# EAGLE design FCC3_Micro (EAGLE 7.2.0)
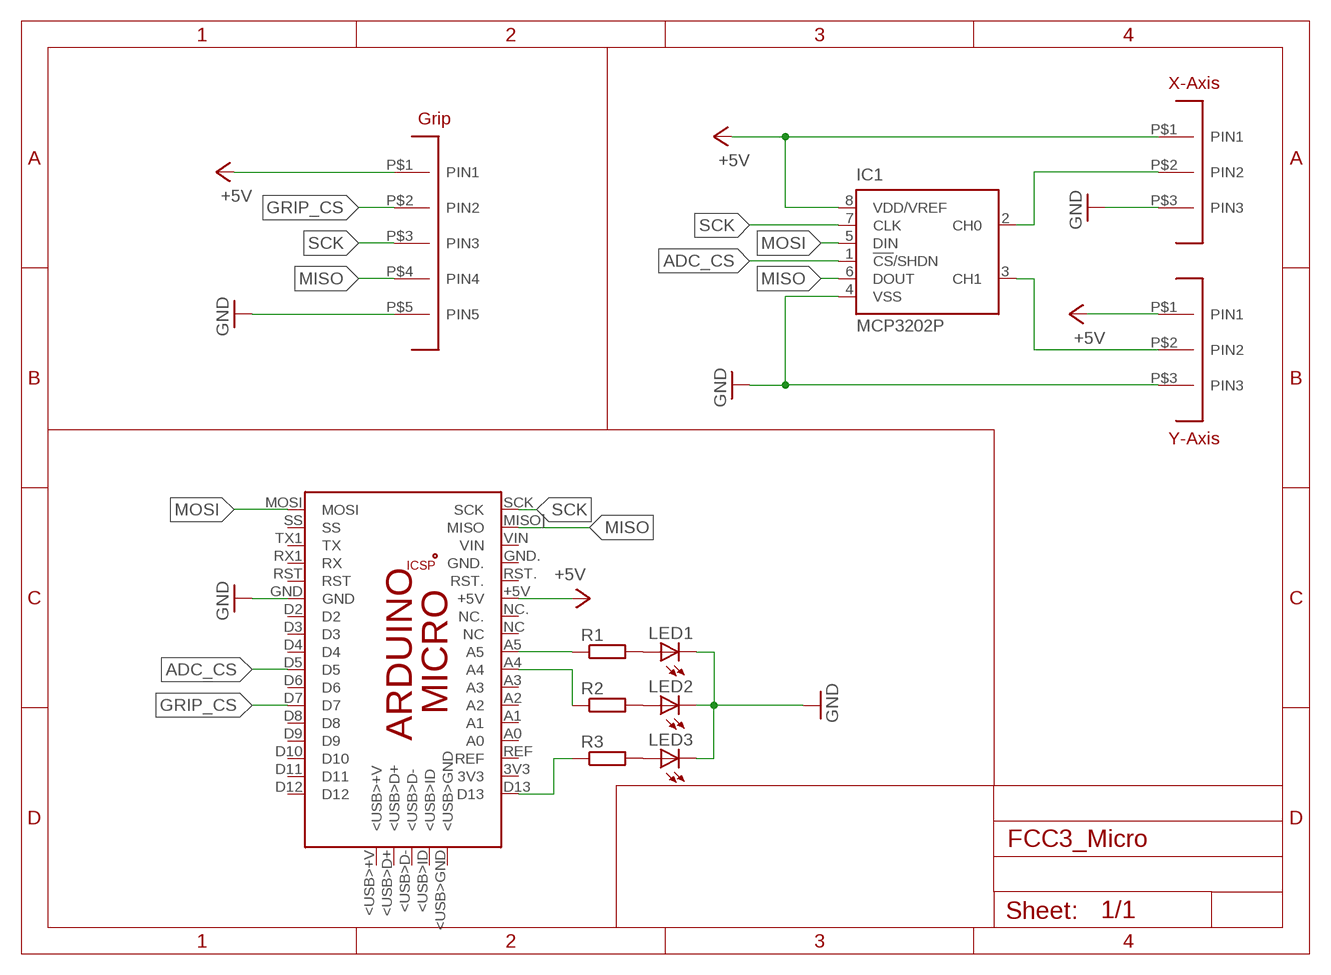
[diagram p0: schematic, sheet 1]

## Parts
IC1  MCP3202P  [DIL8]
LED1  LED5MM  [LED5MM]
LED2  LED5MM  [LED5MM]
LED3  LED5MM  [LED5MM]
PCB1  ARDUINO_MICRO  [ARDUINO_MICRO]
R1  R-EU_0204/5  [0204/5]
R2  R-EU_0204/5  [0204/5]
R3  R-EU_0204/5  [0204/5]
U$1  JST_EH_3PIN  [JST-EH-3PIN]
U$2  JST_EH_3PIN  [JST-EH-3PIN]
U$3  JST_EH_5PIN  [JST-EH-5PIN]

## Nets
+5V [Power]: IC1.8(VDD/VREF) PCB1.+5V U$1.P$1(PIN1) U$2.P$1(PIN1) U$3.P$1(PIN1)
ADC_CS: IC1.1(!CS!/SHDN) PCB1.D5
GND [Power]: IC1.4(VSS) LED1.K(C) LED2.K(C) LED3.K(C) PCB1.GND U$1.P$3(PIN3) U$2.P$3(PIN3) U$3.P$5(PIN5)
GRIP_CS: PCB1.D7 U$3.P$2(PIN2)
MISO: IC1.6(DOUT) PCB1.MISO](MISO) U$3.P$4(PIN4)
MOSI: IC1.5(DIN) PCB1.MOSI
N$1: IC1.2(CH0) U$2.P$2(PIN2)
N$2: IC1.3(CH1) U$1.P$2(PIN2)
N$5: LED3.A R3.2
N$10: LED1.A R1.2
N$11: LED2.A R2.2
SCK: IC1.7(CLK) PCB1.SCK U$3.P$3(PIN3)
STATUS: PCB1.D13 R3.1
X-LED: PCB1.A5 R1.1
Y-LED: PCB1.A4 R2.1
Unconnected: PCB1.3V3 PCB1.5V PCB1.<USB>+V PCB1.<USB>D+ PCB1.<USB>D- PCB1.<USB>GND PCB1.<USB>ID PCB1.A0 PCB1.A1 PCB1.A2 PCB1.A3 PCB1.D2 PCB1.D3 PCB1.D4 PCB1.D6 PCB1.D8 PCB1.D9 PCB1.D10 PCB1.D11 PCB1.D12 PCB1.GND. PCB1.GND_ PCB1.MISO. PCB1.MOSI. PCB1.NC PCB1.NC. PCB1.REF PCB1.RESET.. PCB1.RST PCB1.RST. PCB1.RX1(RX) PCB1.SCK. PCB1.SS PCB1.TX1(TX) PCB1.VIN

## Notes on the sheet
- X-Axis
- Grip
- Y-Axis

## Library data of the parts
IC1 = microchip:MCP3202: 2.7V Dual Channel 12-Bit A/D Converter with SPI Serial Interface Source: http://ww1.microchip.com/downloads/en/DeviceDoc/21034D.pdf; MF: MICROCHIP; MPN: MCP3202-CI/P; OC_FARNELL: 1196794; OC_NEWARK: 72K7287
LED1-LED3 = led:LED: LED OSRAM: - CHIPLED LG R971, LG N971, LY N971, LG Q971, LY Q971, LO R971, LY R971 LH N974, LH R974 LS Q976, LO Q976, LY Q976 LO Q996 - Hyper CHIPLED LW Q18S LB Q993, LB Q99A, LB R99A - SideLED LS A670, LO A670, LY A670, LG A670, LP A670 LB A673, LV A673, LT A673, LW A673 LH A674 LY A675 LS A676, LA A676, LO A676, LY A676, LW A676 LS A679, LY A679, LG A679 - Hyper Micro SIDELED® LS Y876, LA Y876, LO Y876, LY Y876 LT Y87S - SmartLED LW L88C, LW L88S LB L89C, LB L89S, LG L890 LS L89K, LO L89K, LY L89K LS L896, LA L896, LO L896, LY L896 - TOPLED LS T670, LO T670, LY T670, LG T670, LP T670 LSG T670, LSP T670, LSY T670, LOP T670, LYG T670 LG T671, LOG T671, LSG T671 LB T673, LV T673, LT T673, LW T673 LH T674 LS T676, LA T676, LO T676, LY T676, LB T676, LH T676, LSB T676, LW T676 LB T67C, LV T67C, LT T67C, LS T67K, LO T67K, LY T67K, LW E67C LS E67B, LA E67B, LO E67B, LY E67B, LB E67C, LV E67C, LT E67C LW T67C LS T679, LY T679, LG T679 LS T770, LO T770, LY T770, LG T770, LP T770 LB T773, LV T773, LT T773, LW T773 LH T774 LS E675, LA E675, LY E675, LS T675 LS T776, LA T776, LO T776, LY T776, LB T776 LHGB T686 LT T68C, LB T68C - Hyper Mini TOPLED® LB M676 - Mini TOPLED Santana® LG M470 LS M47K, LO M47K, LY M47K Source: http://www.osram.convergy.de LUXEON: - LUMILED® LXK2-PW12-R00, LXK2-PW12-S00, LXK2-PW14-U00, LXK2-PW14-V00 LXK2-PM12-R00, LXK2-PM12-S00, LXK2-PM14-U00 LXK2-PE12-Q00, LXK2-PE12-R00, LXK2-PE12-S00, LXK2-PE14-T00, LXK2-PE14-U00 LXK2-PB12-K00, LXK2-PB12-L00, LXK2-PB12-M00, LXK2-PB14-N00, LXK2-PB14-P00, LXK2-PB14-Q00 LXK2-PR12-L00, LXK2-PR12-M00, LXK2-PR14-Q00, LXK2-PR14-R00 LXK2-PD12-Q00, LXK2-PD12-R00, LXK2-PD12-S00 LXK2-PH12-R00, LXK2-PH12-S00 LXK2-PL12-P00, LXK2-PL12-Q00, LXK2-PL12-R00 Source: www.luxeon.com KINGBRIGHT: KA-3528ASYC Source: www.kingbright.com
PCB1 = E14_Arduino_revC:ARDUINO_MICRO: Device for representing an Arduino Micro board with a footprint in an EAGLE design. Created by Dave Young for Element14. More EAGLE documentation at: http://www.element14.com/community/community/knode/cadsoft_eagle
R1-R3 = resistor:R-EU_: RESISTOR, European symbol
U$1 U$2 = uriba:JST_EH_3PIN
U$3 = uriba:JST_EH_5PIN

## Net classes
0 default: width 0.254 mm, drill 0.254 mm, clearance 0.254 mm
1 Power: width 0.406 mm, drill 0.406 mm, clearance 0.254 mm

## Board
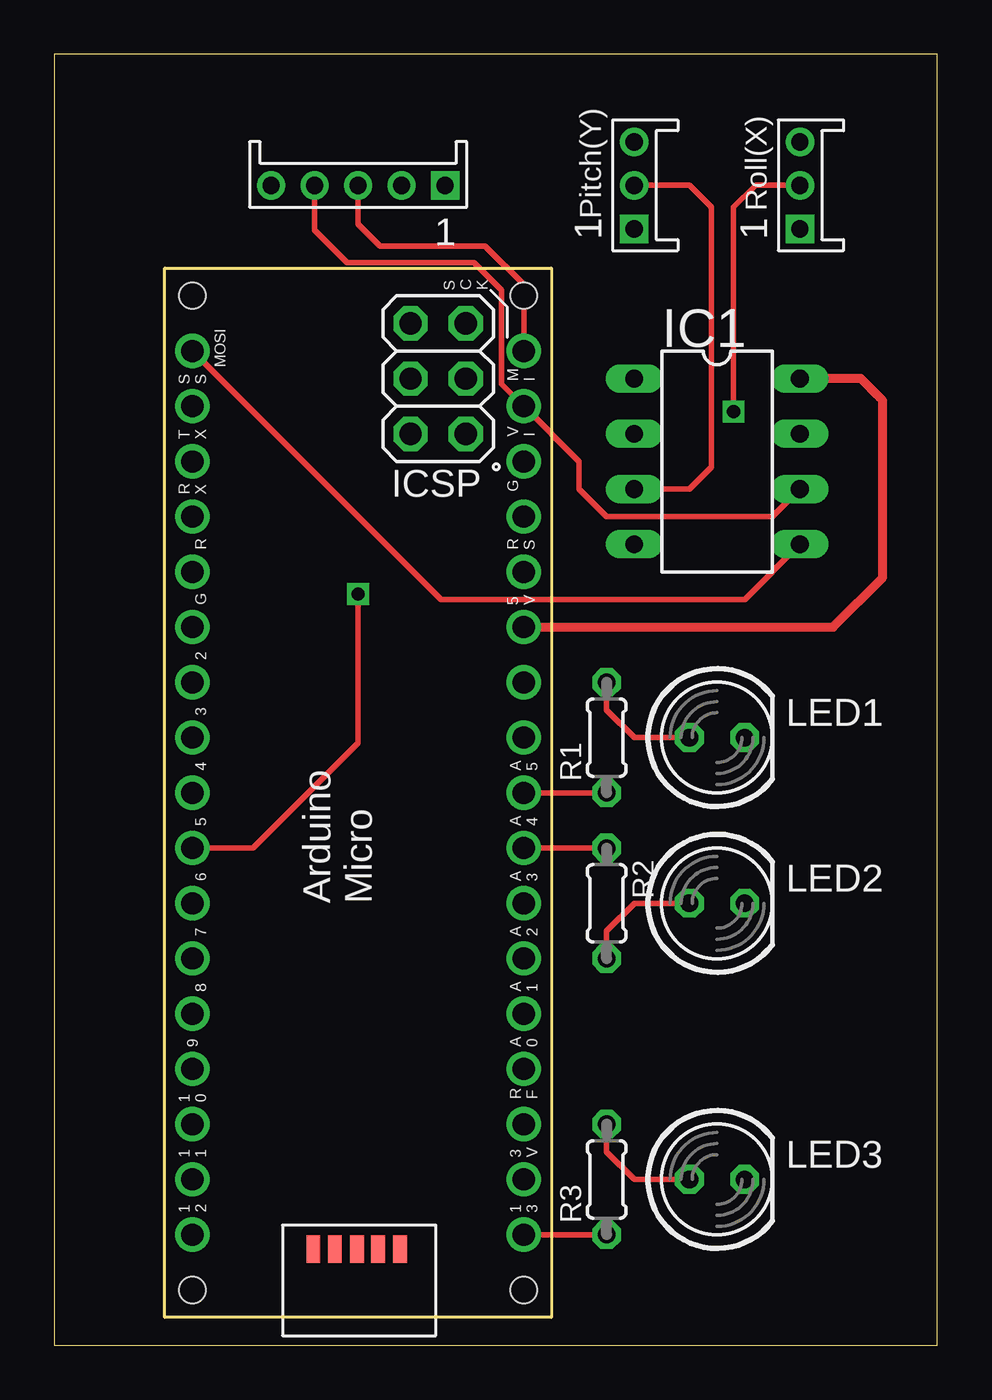
[diagram p1: board, top side]
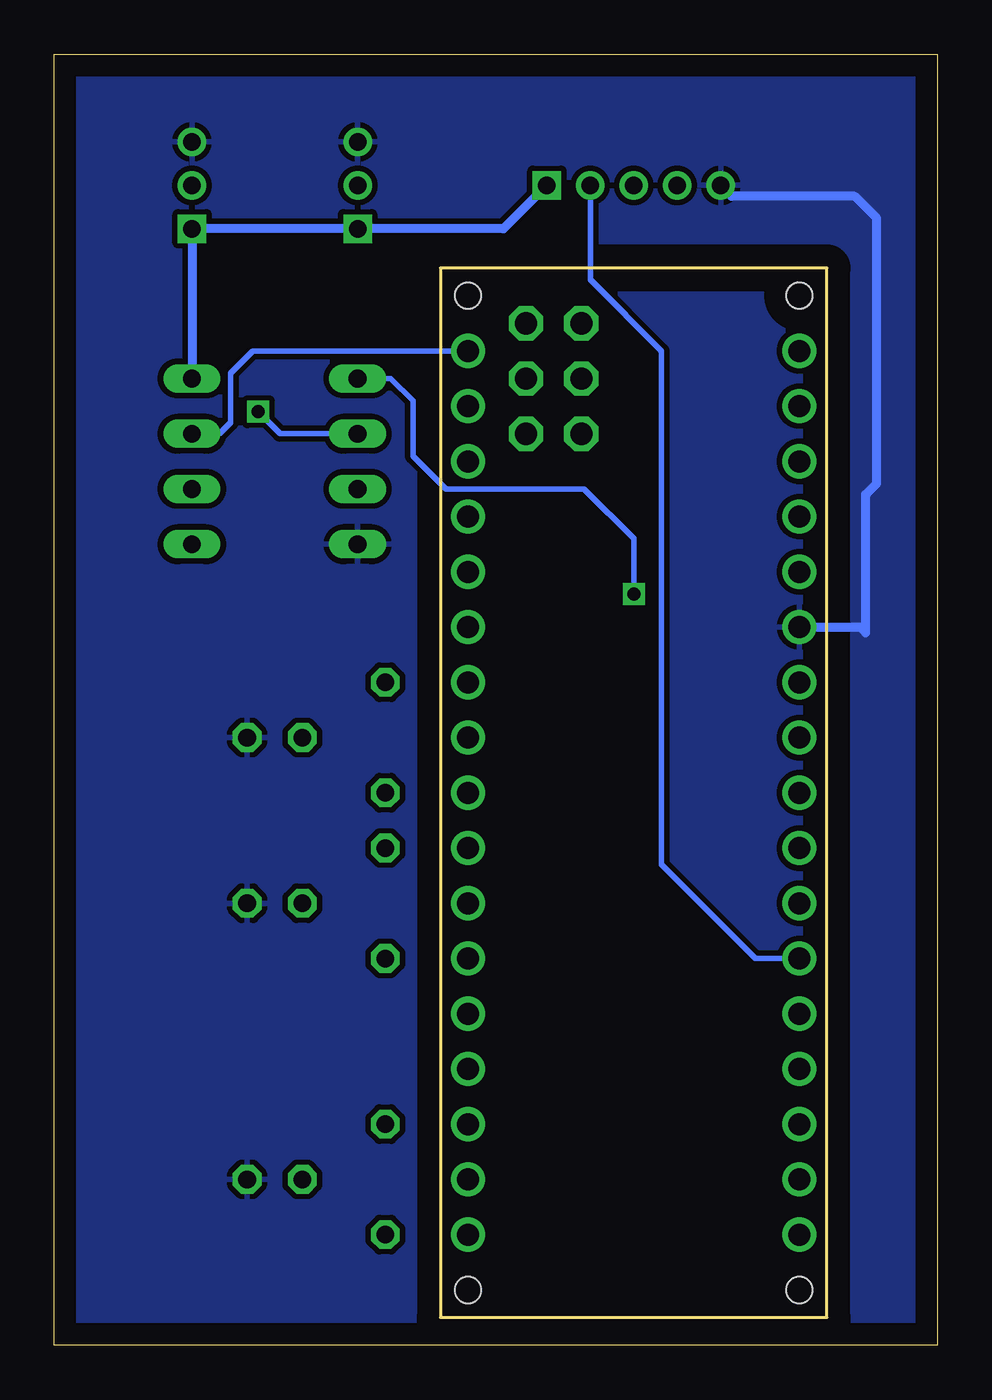
[diagram p2: board, bottom side, seen from below]

Size 40.62 x 59.36 mm. Coordinates in mm from the lower left corner, seen from the top.
Outline: 0,0 40.62,0 40.62,59.36 0,59.36 0,0
Copper layers (1*16): Top 0.035mm / dielectric 1.5mm / Bottom 0.035mm
Design rules "default": minimum track width 10mil, minimum drill 24mil, track to track 8mil, track to pad 8mil, pad to pad 8mil, via to via 8mil, smd to smd 8mil, copper to edge 40mil, drill to drill 8mil, minimum pad ring 10mil, minimum via ring 8mil, stop-mask expansion 4mil, vias tented up to drill 0mil, thermal gap 10mil

### Footprints (pad centres in the part's own frame; a part is rotated, then mirrored left to right if it is on the bottom)
DIL8 = drill 0.813 long: 1 -3.81,-3.81; 2 -1.27,-3.81; 3 1.27,-3.81; 4 3.81,-3.81; 5 3.81,3.81; 6 1.27,3.81; 7 -1.27,3.81; 8 -3.81,3.81
LED5MM = drill 0.813 octagon: A -1.27,0; K 1.27,0
ARDUINO_MICRO = drill 1.016 pad 1.575: 3V3 6.35,1.27; +5V 31.75,1.27; A0 11.43,1.27; A1 13.97,1.27; A2 16.51,1.27; A3 19.05,1.27; A4 21.59,1.27; A5 24.13,1.27; D2 29.21,16.51; D3 26.67,16.51; D4 24.13,16.51; D5 21.59,16.51; D6 19.05,16.51; D7 16.51,16.51; D8 13.97,16.51; D9 11.43,16.51; D10 8.89,16.51; D11 6.35,16.51; D12 3.81,16.51; D13 3.81,1.27; GND 31.75,16.51; GND. 36.83,1.27; MISO] 41.91,1.27; MOSI 44.45,16.51; NC 26.67,1.27; NC. 29.21,1.27; REF 8.89,1.27; RST 34.29,16.51; RST. 34.29,1.27; RX1 36.83,16.51; SCK 44.45,1.27; SS 41.91,16.51; TX1 39.37,16.51; VIN 39.37,1.27 | drill 1.016 pad 1.575 octagon: 5V 40.64,6.477; GND_ 45.72,6.477; MISO. 40.64,3.937; MOSI. 43.18,6.477; RESET.. 45.72,3.937; SCK. 43.18,3.937 | smd 1.27 x 0.635: <USB>+V 3.15,10.947; <USB>D+ 3.15,9.957; <USB>D- 3.15,8.941; <USB>GND 3.15,6.96; <USB>ID 3.15,7.976 | hole 1.2: 1.27,1.27; 1.27,16.51; 46.99,16.51; 46.99,1.27
0204/5 = drill 0.813 octagon: 1 -2.54,0; 2 2.54,0
JST-EH-3PIN = drill 0.8 square: P$1 2,0 | drill 0.8: P$2 0,0; P$3 -2,0
JST-EH-5PIN = drill 0.8 square: P$1 4,0 | drill 0.8: P$2 2,0; P$3 0,0; P$4 -2,0; P$5 -4,0

### Placement (x,y rotation side)
IC1  30.48,40.64 270 top
LED1  30.48,27.94 0 top
LED2  30.48,20.32 0 top
LED3  30.48,7.62 0 top
PCB1  22.86,1.27 90 top
R1  25.4,27.94 90 top
R2  25.4,20.32 270 top
R3  25.4,7.62 90 top
U$1  26.67,53.34 270 top
U$2  34.29,53.34 270 top
U$3  13.97,53.34 0 top

### Tracks (layer width: path | path; a pad name or v marks a point on that pad's centre or on a via)
+5V
  Top 0.406: PCB1.+5V 35.81,33.02 38.1,35.31 38.1,43.43 37.08,44.45 IC1.8
  Bottom 0.406: U$3.P$1 19.97,51.34 U$1.P$1 U$2.P$1 IC1.8
ADC_CS  (via drill 0.6)
  Top 0.254: PCB1.D5 9.14,22.86 13.97,27.69 v13.97,34.54
  Bottom 0.254: v13.97,34.54 13.97,37.08 16.26,39.37 22.61,39.37 24.13,40.89 24.13,43.43 25.15,44.45 IC1.1
GND
  Bottom 0.406: PCB1.GND 3.56,33.02 3.3,32.77 3.3,39.12 2.79,39.62 2.79,51.82 3.81,52.83 9.46,52.83 U$3.P$5
  pour Bottom: -2.54,62.23 44.2,62.23 42.16,-3.3 -3.81,-1.78
GRIP_CS
  Bottom 0.254: U$3.P$2 15.97,48.99 12.7,45.72 12.7,22.1 8.38,17.78 PCB1.D7
MISO
  Top 0.254: U$3.P$4 11.97,51.28 13.46,49.78 19.3,49.78 20.57,48.51 20.57,44.2 PCB1.MISO] 24.13,40.64 24.13,39.37 25.4,38.1 33.02,38.1 IC1.6
MOSI
  Top 0.254: IC1.5 31.75,34.29 17.78,34.29 PCB1.MOSI
N$1  (via drill 0.6)
  Top 0.254: U$2.P$2 32.26,53.34 31.24,52.32 v31.24,42.93
  Bottom 0.254: v31.24,42.93 30.23,41.91 IC1.2
N$2
  Top 0.254: U$1.P$2 29.21,53.34 30.23,52.32 30.23,40.39 29.21,39.37 IC1.3
N$5
  Top 0.254: R3.2 25.4,8.89 26.67,7.62 LED3.A
N$10
  Top 0.254: R1.2 25.4,29.21 26.67,27.94 LED1.A
N$11
  Top 0.254: R2.2 25.4,19.05 26.67,20.32 LED2.A
SCK
  Top 0.254: U$3.P$3 13.97,51.56 14.99,50.55 19.81,50.55 21.59,48.77 PCB1.SCK
  Bottom 0.254: PCB1.SCK 31.5,45.72 32.51,44.7 32.51,42.42 33.02,41.91 IC1.7
STATUS
  Top 0.254: PCB1.D13 R3.1
X-LED
  Top 0.254: R1.1 PCB1.A5
Y-LED
  Top 0.254: R2.1 PCB1.A4

### Text on the board
tNames: Pitch(Y) | Roll(X)